# Altium schematic sheet Fri3d_2026_Keeb_00.SchDoc: Communicator Add-On
size A3; Date: 03/03/2026; DrawnBy: Wim Van Gool; DocumentNumber: 1; Revision: 00; SheetNumber: 1; SheetTotal: 1
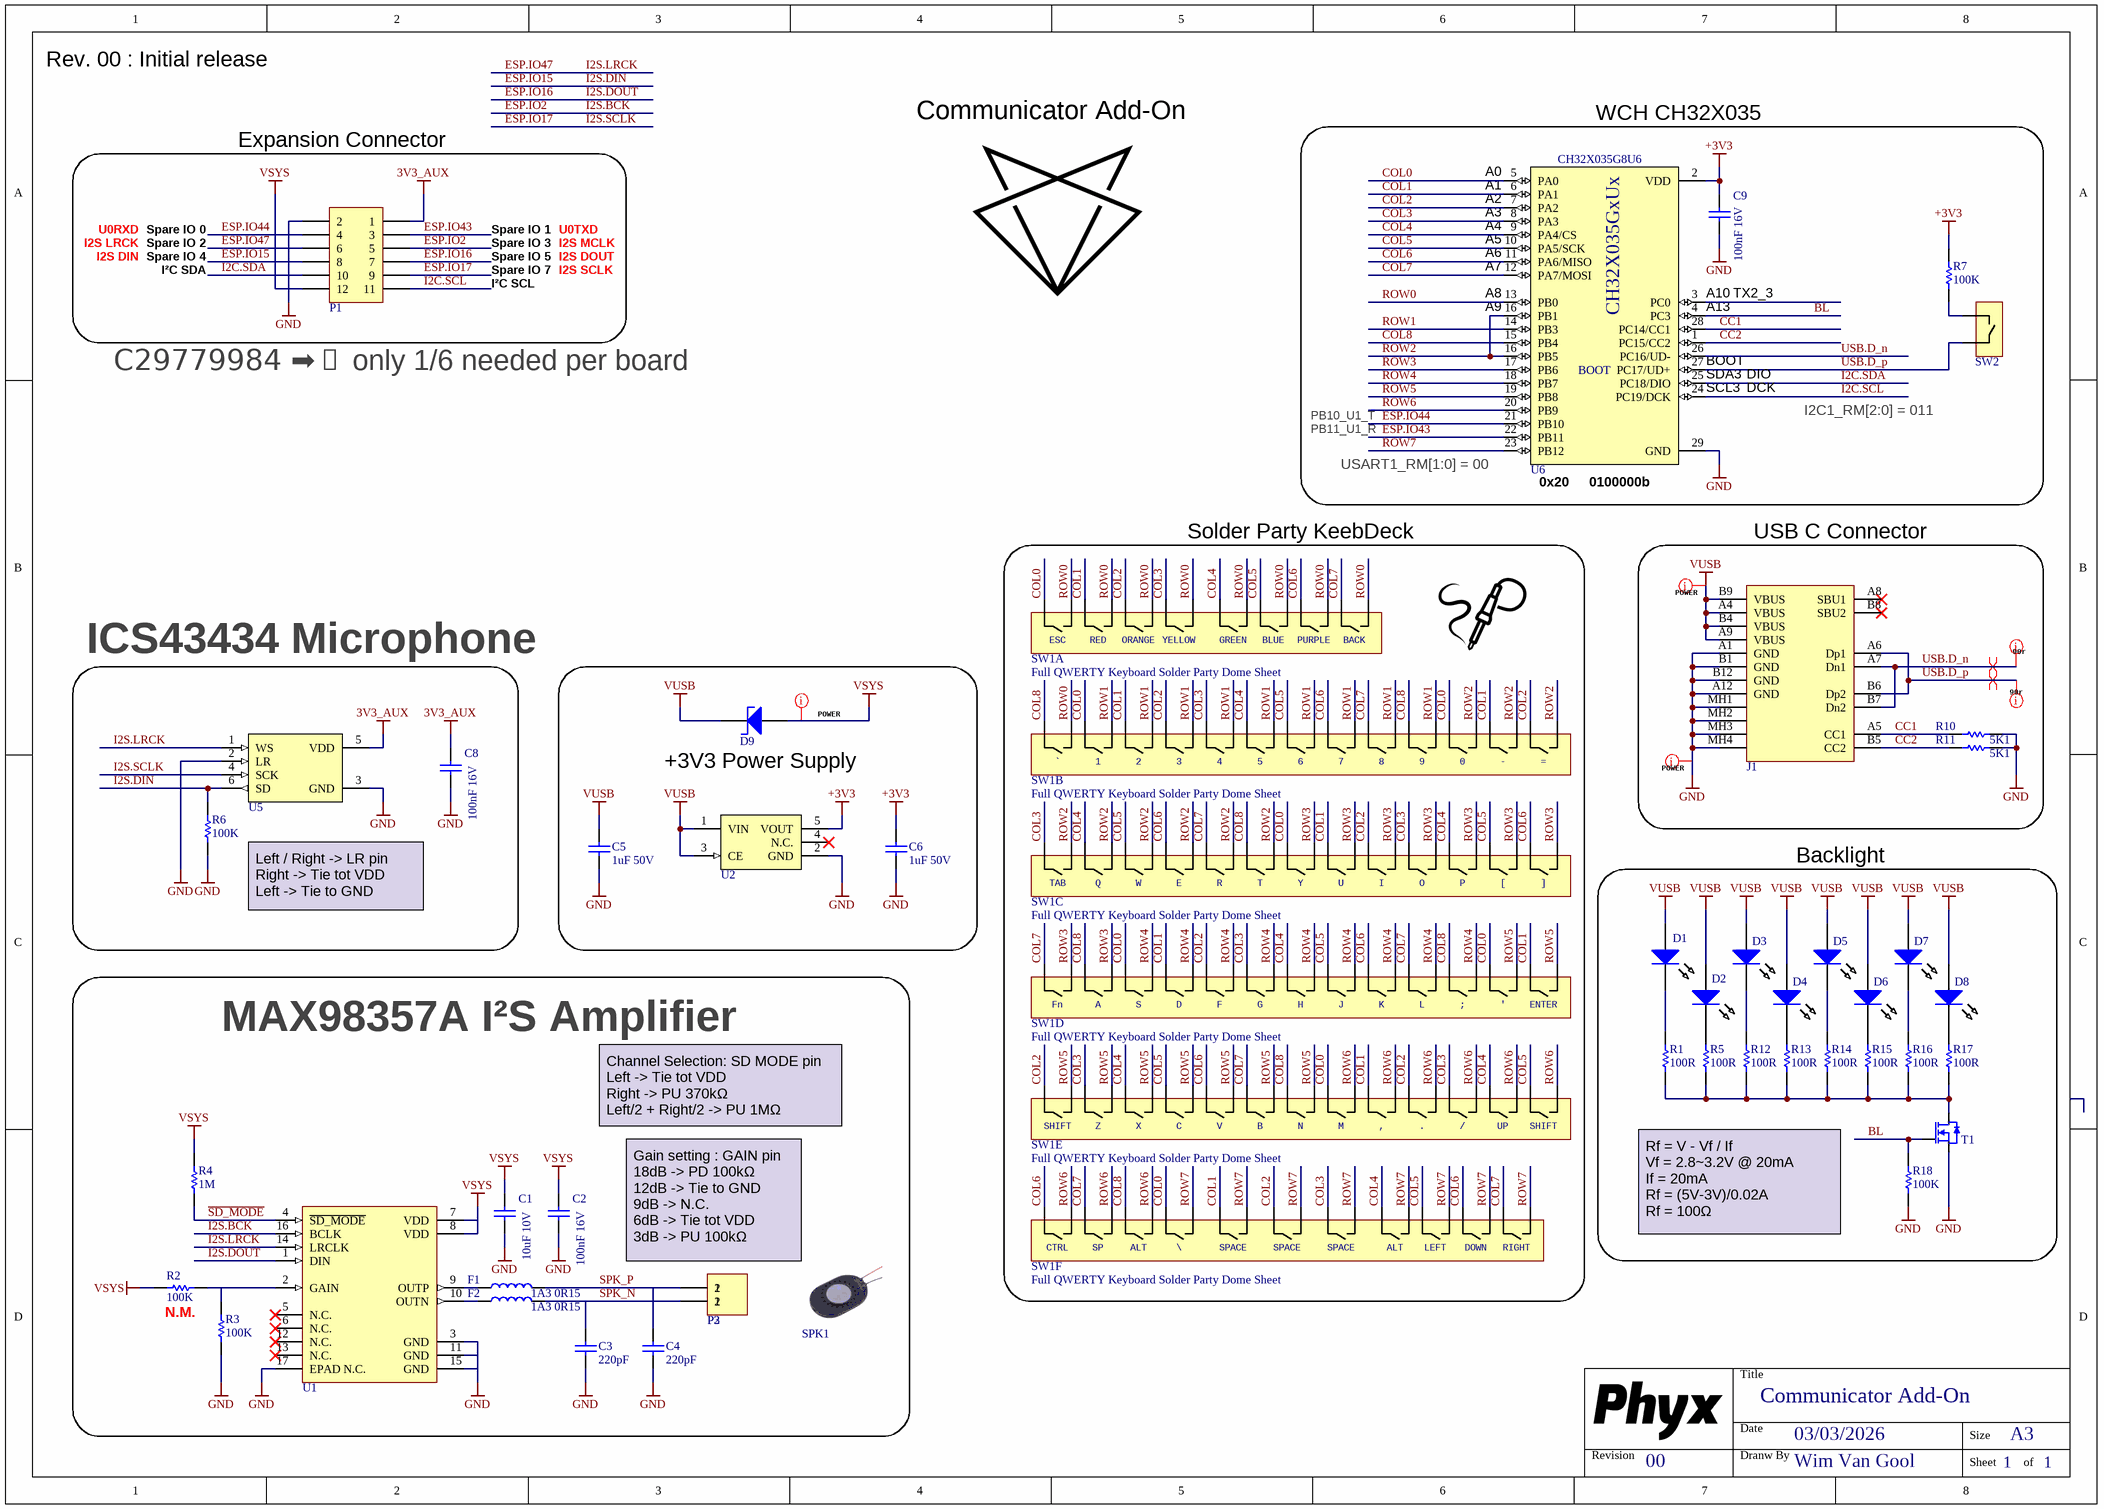
[diagram p0: Fri3d_2026_Keeb_00.SchDoc]

## Parts
C1  value 10uF 10V  [C0805_N]  (hidden comment: CAP_CERAMIC)
C2  value 100nF 16V  [C0603_N]
C3  value 220pF  [C0603_N]  (hidden comment: CAP_CERAMIC)
C4  value 220pF  [C0603_N]  (hidden comment: CAP_CERAMIC)
C5  value 1uF 50V  [C0603_N]  (hidden comment: CAP_CERAMIC)
C6  value 1uF 50V  [C0603_N]  (hidden comment: CAP_CERAMIC)
C8  value 100nF 16V  [C0603_N]
C9  value 100nF 16V  [C0603_N]
D1  Side emitting Cool White LED 3.0V 30mA 120° 2900mcd  [LITE_LTW-010DCG]  (value not drawn)
D2  Side emitting Cool White LED 3.0V 30mA 120° 2900mcd  [LITE_LTW-010DCG]  (value not drawn)
D3  Side emitting Cool White LED 3.0V 30mA 120° 2900mcd  [LITE_LTW-010DCG]  (value not drawn)
D4  Side emitting Cool White LED 3.0V 30mA 120° 2900mcd  [LITE_LTW-010DCG]  (value not drawn)
D5  Side emitting Cool White LED 3.0V 30mA 120° 2900mcd  [LITE_LTW-010DCG]  (value not drawn)
D6  Side emitting Cool White LED 3.0V 30mA 120° 2900mcd  [LITE_LTW-010DCG]  (value not drawn)
D7  Side emitting Cool White LED 3.0V 30mA 120° 2900mcd  [LITE_LTW-010DCG]  (value not drawn)
D8  Side emitting Cool White LED 3.0V 30mA 120° 2900mcd  [LITE_LTW-010DCG]  (value not drawn)
D9  CUS10S30 Schottky Power Rectifier, 1A, 30V  [SOD-323_AC]  (value not drawn)
F1  value 1A3 0R15  [L0603]  (hidden comment: BLM18KG601SN1D)
F2  value 1A3 0R15  [L0603]  (hidden comment: BLM18KG601SN1D)
J1  USB 2.0 C Reversible Receptacle Horizontal full SMD  [XUNPU-TYPEC-304S-ACP16]  (value not drawn)
P1  Header 6X2  [HDR2X6]  (value not drawn)
P2  Header 2.0mm Shrouded 2  [WE_620102131822]  (value not drawn)
P3  Header 2 RA  [HDR1X2_RA]  (value not drawn)
R1  value 100R  [R0603_N]  (hidden comment: RESISTOR)
R2  value 100K  [R0603_N]  (hidden comment: RESISTOR)
R3  value 100K  [R0603_N]  (hidden comment: RESISTOR)
R4  value 1M  [R0603_N]  (hidden comment: RESISTOR)
R5  value 100R  [R0603_N]  (hidden comment: RESISTOR)
R6  value 100K  [R0603_N]  (hidden comment: RESISTOR)
R7  value 100K  [R0603_N]  (hidden comment: RESISTOR)
R10  value 5K1  [R0603_N]  (hidden comment: RESISTOR)
R11  value 5K1  [R0603_N]  (hidden comment: RESISTOR)
R12  value 100R  [R0603_N]  (hidden comment: RESISTOR)
R13  value 100R  [R0603_N]  (hidden comment: RESISTOR)
R14  value 100R  [R0603_N]  (hidden comment: RESISTOR)
R15  value 100R  [R0603_N]  (hidden comment: RESISTOR)
R16  value 100R  [R0603_N]  (hidden comment: RESISTOR)
R17  value 100R  [R0603_N]  (hidden comment: RESISTOR)
R18  value 100K  [R0603_N]  (hidden comment: RESISTOR)
SPK1  INGHAi GSPK3020035PN 8R 1W 100mm Leads  (value not drawn)
SW1  Full QWERTY Keyboard Solder Party Dome Sheet  [Solder_Party_Keyb]  (parts A,B,C,D,E,F of 6)
SW2  4.5x4.5mm tact SMD H3,8mm  [WE_430181038816]  (value not drawn)
T1  0.2A N-Ch MOSFET Vgs 1.5  [SOT23-3]  (value not drawn)
U1  Mono I²S DAC AMP 3W 2.5~5.5V  [QFN_16_0.5_3X3]  (value not drawn)
U2  3V3 LDO 300mA 150mV  [SOT23-5]  (value not drawn)
U5  I2S MIC ICS-43434  [TDK_ICS-43434]  (value not drawn)
U6  value CH32X035G8U6  [QFN_28_4.0x4.0_P0.4]  (hidden comment: WCH CH32X035G8U6 QFN28 RISC-V 32-bit MCU, 62KB Flash, 10KB RAM, USB PD)

## Blocks framed on the sheet
WCH CH32X035: C9 R7 SW2 U6
C29779984 ➡️ only 1/6 needed per board: P1
Solder Party KeebDeck: SW1
USB C Connector: J1 R10 R11
+3V3 Power Supply: C5 C6 D9 U2
Backlight: D1-D8 R1 R5 R12-R18 T1
MAX98357A I²S Amplifier: C1-C4 F1 F2 P2 P3 R2-R4 SPK1 U1

## Nets
3V3_AUX: C8.1 P1.1 U5.5(VDD)
+3V3: C6.1 C9.1 R7.1 U2.5(VOUT) U6.2(VDD)
GND: C1.2 C2.2 C3.2 C4.2 C5.2 C6.2 C8.2 C9.2 J1.A1(GND) J1.A12(GND) J1.B1(GND) J1.B12(GND) J1.MH1(Tab) J1.MH2(Tab) J1.MH3(Tab) J1.MH4(Tab) P1.2 R3.2 R6.2 R10.2 R11.2 R18.2 T1.2(S) U1.3(GND) U1.11(GND) U1.15(GND) U1.17(EPAD_N.C.) U2.2(GND) U5.2(LR) U5.3(GND) U6.29(GND)
VSYS: C1.1 C2.1 D9.A P1.12 R2.2 R4.1 U1.7(VDD) U1.8(VDD)
VUSB: C5.1 D1.1(A) D2.1(A) D3.1(A) D4.1(A) D5.1(A) D6.1(A) D7.1(A) D8.1(A) D9.C J1.A4(VBUS) J1.A9(VBUS) J1.B4(VBUS) J1.B9(VBUS) U2.1(VIN) U2.3(CE)
BL: R18.1 T1.1(G) U6.4(PC3)
CC1: J1.A5(CC1) R10.1 U6.28(PC14/CC1)
CC2: J1.B5(CC2) R11.1 U6.1(PC15/CC2)
COL0: SW1.1 SW1.19 SW1.37 SW1.55 SW1.73 SW1.91 SW1.109 SW1.127 U6.5(PA0)
COL1: SW1.3 SW1.21 SW1.39 SW1.57 SW1.75 SW1.93 SW1.111 SW1.129 U6.6(PA1)
COL2: SW1.5 SW1.23 SW1.41 SW1.59 SW1.77 SW1.95 SW1.113 SW1.131 U6.7(PA2)
COL3: SW1.7 SW1.25 SW1.43 SW1.61 SW1.79 SW1.97 SW1.115 SW1.133 U6.8(PA3)
COL4: SW1.9 SW1.27 SW1.45 SW1.63 SW1.81 SW1.99 SW1.117 SW1.135 U6.9(PA4/CS)
COL5: SW1.11 SW1.29 SW1.47 SW1.65 SW1.83 SW1.101 SW1.119 SW1.137 U6.10(PA5/SCK)
COL6: SW1.13 SW1.31 SW1.49 SW1.67 SW1.85 SW1.103 SW1.121 SW1.139 U6.11(PA6/MISO)
COL7: SW1.15 SW1.33 SW1.51 SW1.69 SW1.87 SW1.105 SW1.123 SW1.141 U6.12(PA7/MOSI)
COL8: SW1.17 SW1.35 SW1.53 SW1.71 SW1.89 SW1.107 SW1.125 U6.15(PB4)
ESP.IO2: P1.5 U1.16(BCLK)  [also labelled I2S.BCK]
ESP.IO15: P1.8 R6.1 U5.6(SD)  [also labelled I2S.DIN]
ESP.IO16: P1.7 U1.1(DIN)  [also labelled I2S.DOUT]
ESP.IO17: P1.9 U5.4(SCK)  [also labelled I2S.SCLK]
ESP.IO43: P1.3 U6.22(PB11)
ESP.IO44: P1.4 U6.21(PB10)
ESP.IO47: P1.6 U1.14(LRCLK) U5.1(WS)  [also labelled I2S.LRCK]
I2C.SCL: P1.11 U6.24(PC19/DCK)
I2C.SDA: P1.10 U6.25(PC18/DIO)
ROW0: SW1.2 SW1.4 SW1.6 SW1.8 SW1.10 SW1.12 SW1.14 SW1.16 SW1.18 U6.13(PB0)
ROW1: SW1.20 SW1.22 SW1.24 SW1.26 SW1.28 SW1.30 SW1.32 SW1.34 SW1.36 U6.14(PB3)
ROW2: SW1.38 SW1.40 SW1.42 SW1.44 SW1.46 SW1.48 SW1.50 SW1.52 SW1.54 U6.16(PB1)
ROW3: SW1.56 SW1.58 SW1.60 SW1.62 SW1.64 SW1.66 SW1.68 SW1.70 SW1.72 U6.17(PB6)
ROW4: SW1.74 SW1.76 SW1.78 SW1.80 SW1.82 SW1.84 SW1.86 SW1.88 SW1.90 U6.18(PB7)
ROW5: SW1.92 SW1.94 SW1.96 SW1.98 SW1.100 SW1.102 SW1.104 SW1.106 SW1.108 U6.19(PB8)
ROW6: SW1.110 SW1.112 SW1.114 SW1.116 SW1.118 SW1.120 SW1.122 SW1.124 SW1.126 U6.20(PB9)
ROW7: SW1.128 SW1.130 SW1.132 SW1.134 SW1.136 SW1.138 SW1.140 SW1.142 U6.23(PB12)
~{SD_MODE}: R4.2 U1.4(~{SD_MODE})
SPK_N: C3.1 F2.2 P2.2 P3.1
SPK_P: C4.1 F1.2 P2.1 P3.2
USB.D_n: J1.A7(Dn1) J1.B7(Dn2) U6.26(PC16/UD-)
USB.D_p: J1.A6(Dp1) J1.B6(Dp2) SW2.2 U6.27(PC17/UD+)
NetD1_2: D1.2(K) R1.1
NetD2_2: D2.2(K) R5.1
NetD3_2: D3.2(K) R12.1
NetD4_2: D4.2(K) R13.1
NetD5_2: D5.2(K) R14.1
NetD6_2: D6.2(K) R15.1
NetD7_2: D7.2(K) R16.1
NetD8_2: D8.2(K) R17.1
NetF1_1: F1.1 U1.9(OUTP)
NetF2_1: F2.1 U1.10(OUTN)
NetR1_2: R1.2 R5.2 R12.2 R13.2 R14.2 R15.2 R16.2 R17.2 T1.3(D)
NetR2_1: R2.1 R3.1 U1.2(GAIN)
NetR7_2: R7.2 SW2.1

Not connected (* = marked no-connect by the designer): J1 A8(SBU1)* B8(SBU2)*; U1 5(N.C.)* 6(N.C.)* 12(N.C.)* 13(N.C.)*; U2 4(N.C.)*; U6 3(PC0)

## Layout directives
net class 90r: USB.D_n, USB.D_p
differential pair: USB.D_n, USB.D_p
net class POWER: GND, VSYS, VUSB

## Notes on the sheet
- Rev. 00 : Initial release
- Expansion Connector
- (near U6) A0
- I2S LRCK
- I2S DIN
- U0RXD
- Spare IO 0
- Spare IO 2
- Spare IO 4
- Spare IO 1
- Spare IO 3
- Spare IO 5
- I2S MCLK
- I2S DOUT
- U0TXD
- (near U6) A1
- (near U6) A2
- (near U6) A3
- (near U6) A4
- (near U6) A5
- I²C SDA
- I²C SCL
- Spare IO 7
- I2S SCLK
- (near U6) A6
- (near U6) A7
- (near U6) A8
- (near U6) A9
- (near U6) A10
- (near U6) A13
- TX2_3
- (near U6) BOOT
- (near U6) SDA3
- DIO
- PB10_U1_T
- PB11_U1_R
- (near U6) SCL3
- DCK
- I2C1_RM[2:0] = 011
- (near U6) USART1_RM[1:0] = 00
- (near U6) 0x20
- (near U6) 0100000b
- ICS43434 Microphone
- Left / Right -> LR pin
  Right -> Tie tot VDD
  Left -> Tie to GND
- Channel Selection: SD MODE pin
  Left -> Tie tot VDD
  Right -> PU 370kΩ
  Left/2 + Right/2 -> PU 1MΩ
- Gain setting : GAIN pin
  18dB -> PD 100kΩ
  12dB -> Tie to GND
  9dB -> N.C.
  6dB -> Tie tot VDD
  3dB -> PU 100kΩ
- Rf = V - Vf / If
  Vf = 2.8~3.2V @ 20mA
  If = 20mA
  Rf = (5V-3V)/0.02A
  Rf = 100Ω
- (near R2) N.M.
- Title
- Revision
- Date
- Dranw By
- Size
- Sheet
- of
- (in symbol RISCV # CH32X035G8U6) CH32X035GxUx; BOOT
- (in symbol Solder_Party_Keyb, part A) ESC; RED; ORANGE; YELLOW; GREEN; BLUE; PURPLE; BACK
- (in symbol Solder_Party_Keyb, part B) `; 0; -
- (in symbol Solder_Party_Keyb, part C) TAB; Q; W; E; R; T; Y; U; I; O; P; [; ]
- (in symbol Solder_Party_Keyb, part D) Fn; A; S; D; F; G; H; J; K; L; ;; '; ENTER
- (in symbol Solder_Party_Keyb, part E) SHIFT; Z; X; C; V; B; N; M; ,; .; /; UP
- (in symbol Solder_Party_Keyb, part F) CTRL; SP; ALT; \; SPACE; LEFT; DOWN; RIGHT

## Library data of the parts
C1 = CAP # 10uF 10V 0805: Capacitor Ceramic; Supplier 1: Farnell; Supplier Part Number 1: 2320859
C2 C8 C9 = CAP # 100nF 16V 0603: Capacitor Ceramic
C3 C4 = CAP # 220pF 50V 0603: Capacitor Ceramic; Supplier 1: LCSC; Supplier Part Number 1: C5254623; Supplier 2: LCSC; Supplier Part Number 2: C107081; Supplier 3: Generic; Supplier Part Number 3: 220pF 0603
C5 C6 = CAP # 1uF 50V 0603: Capacitor Ceramic; Supplier 1: Farnell; Supplier Part Number 1: 2112858; Supplier 3: Generic; Supplier Part Number 3: 1uF 50V 0603 X7R
D1-D8 = LED # White Side Emitting LTW-010DCG-SR-G: =Description; Value: LTW-010DCG-SR-G; Supplier 1: LCSC; Supplier Part Number 1: C5175311; Supplier 2: LCSC; Supplier Part Number 2: C5175309; Supplier 3: LCSC; Supplier Part Number 3: C5175310
D9 = Schottky # CUS10S30: =Description; Value: CUS10S30,H3F; Supplier 1: LCSC; Supplier Part Number 1: C146335
F1 F2 = FER # 600R 1A3 0603 0R15 BLM18KG601SN1D: Supplier 1: Farnell; Supplier Part Number 1: 1781094
J1 = USB # C 2.0 RCPT TYPEC-304S-ACP16: Value: TYPEC-304S-ACP16; Supplier 1: LCSC; Supplier Part Number 1: C720630
P1 = Pin Header 2.54mm dual row 12way
P2 = HDR # SHR 2.0mm 2way - 620102131822: Value: 620102131822; Supplier 1: Wurth; Supplier Part Number 1: 620102131822; Supplier 2: Mouser; Supplier Part Number 2: 710-620102131822
P3 = Pin Header 2.54mm 2way RA
R1 R5 R12-R17 = RES # 100R 0603: Supplier 1: Farnell; Supplier Part Number 1: 2446544; Supplier 2: LCSC; Supplier Part Number 2: C22775; Supplier 3: Generic; Supplier Part Number 3: 100R 1% 0603
R2 R3 R6 R7 R18 = RES # 100K 0603: Supplier 3: Generic; Supplier Part Number 3: 100K 1% 0603
R4 = RES # 1M 0603: Supplier 3: Generic; Supplier Part Number 3: 1M 1% 0603
R10 R11 = RES # 5K1 0603: Supplier 1: Farnell; Supplier Part Number 1: 2845922
SPK1 = SPEAKER 8R 1W 10cm: Value: GSPK3020035PN-8R1.0W-L100; Supplier 1: LCSC; Supplier Part Number 1: C530556
SW1 = Solder_Party_Keyb
SW2 = SW # TACT small 4.5x4.5mm SMD WS-TASV: Value: 430181038816; Supplier 1: Wurth; Supplier Part Number 1: 430181038816; Supplier 2: Mouser; Supplier Part Number 2: 710-430181038816; Supplier 3: LCSC; Supplier Part Number 3: C174049
T1 = BSS138 N-Ch MOSFET 0.2A 1.5Vgs 60Vds: Value: BSS138; Supplier 1: Farnell; Supplier Part Number 1: 2432717; Supplier 2: LCSC; Supplier Part Number 2: C426569; Supplier 3: LCSC; Supplier Part Number 3: C5224260 / C5224267
U1 = AMP # AUD MAX98357A: =Description; Value: MAX98357A; Supplier 1: Farnell; Supplier Part Number 1: 2949165
U2 = LDO # 3V3 300mA RT9078-33GJ5: =Designator; Value: RT9078-33GJ5; Supplier 1: LCSC; Supplier Part Number 1: C110427
U5 = MIC # MEMS I2S ICS-43434: =Description; Value: ICS-43434; Supplier 1: Mouser; Supplier Part Number 1: 410-ICS-43434; Supplier 2: Farnell; Supplier Part Number 2: 2911502
U6 = RISCV # CH32X035G8U6: Supplier 1: LCSC; Supplier Part Number 1: C7437027